# EasyEDA Pro project can-mcu.eprj, board remote-dim-a
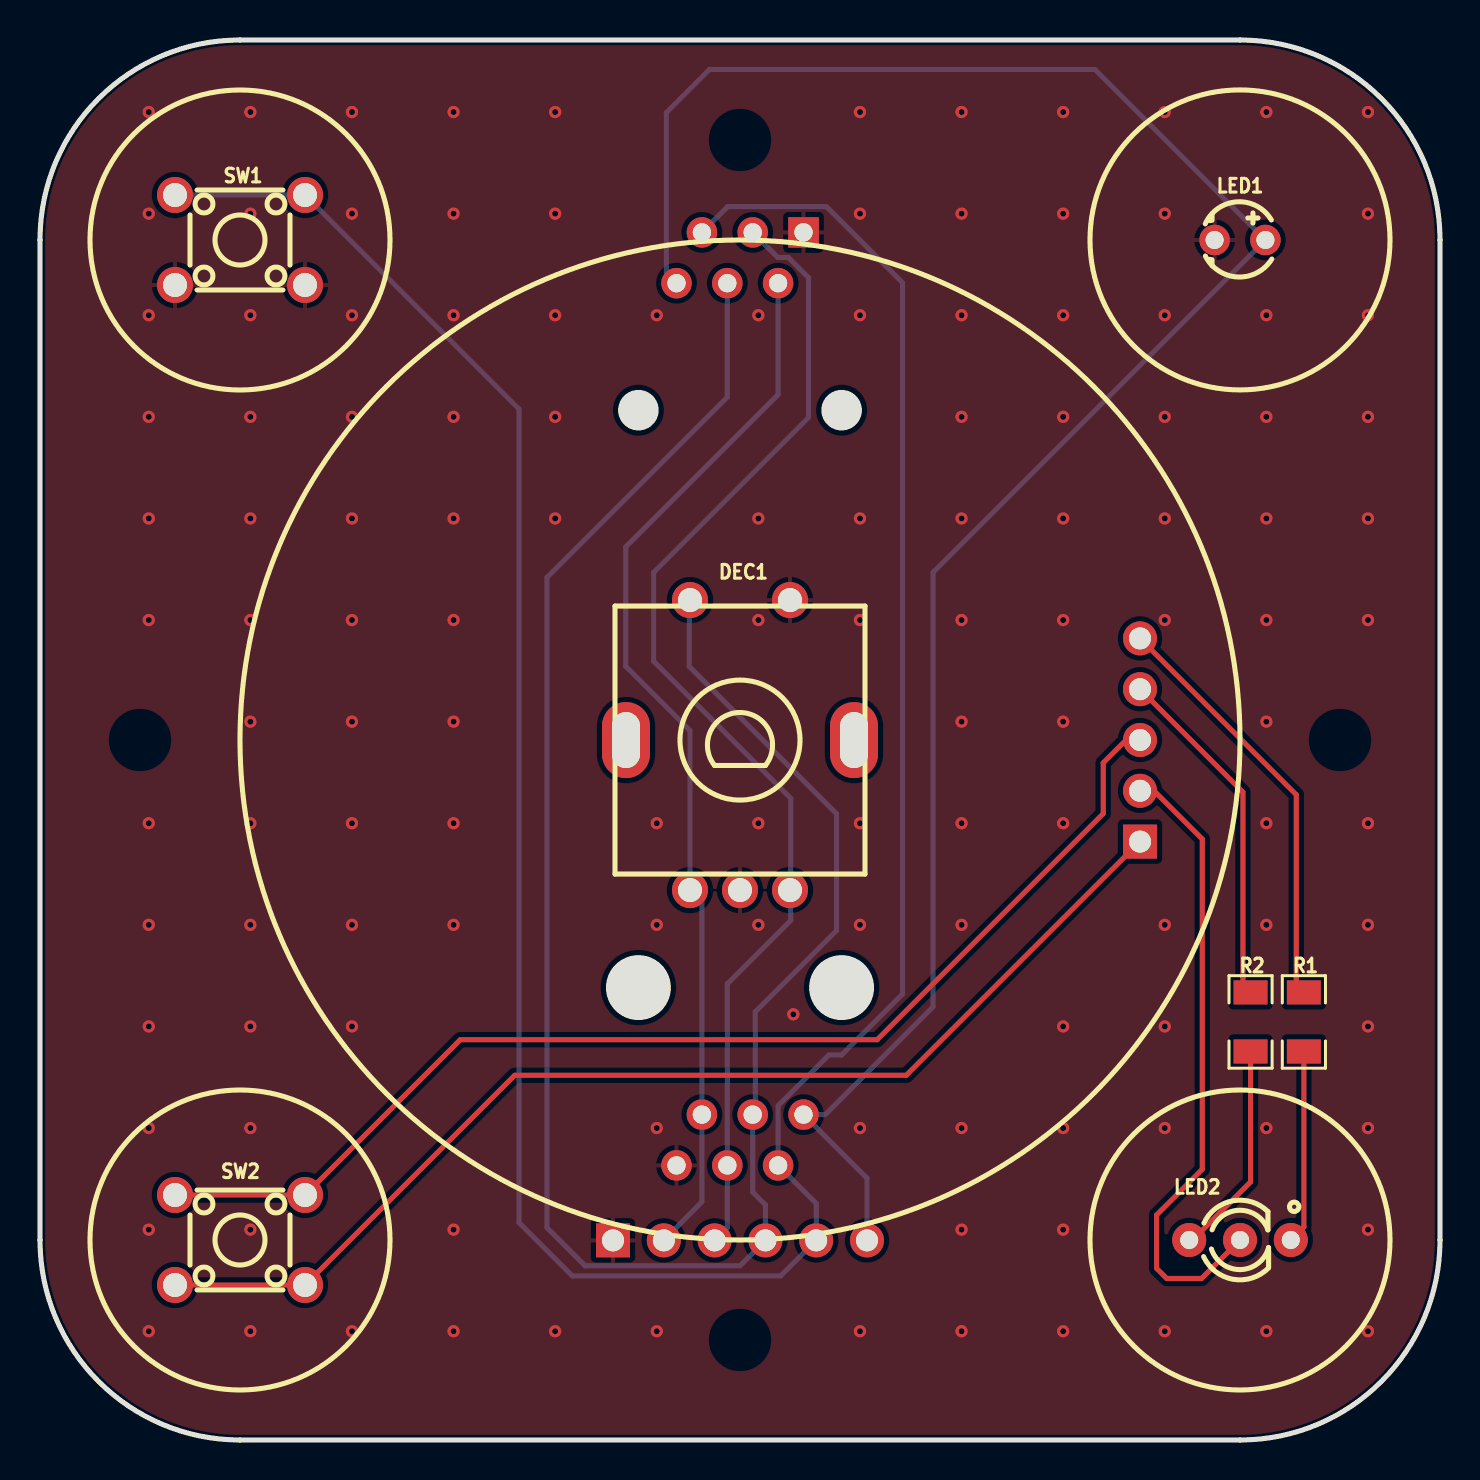
[diagram p15: board, top side]
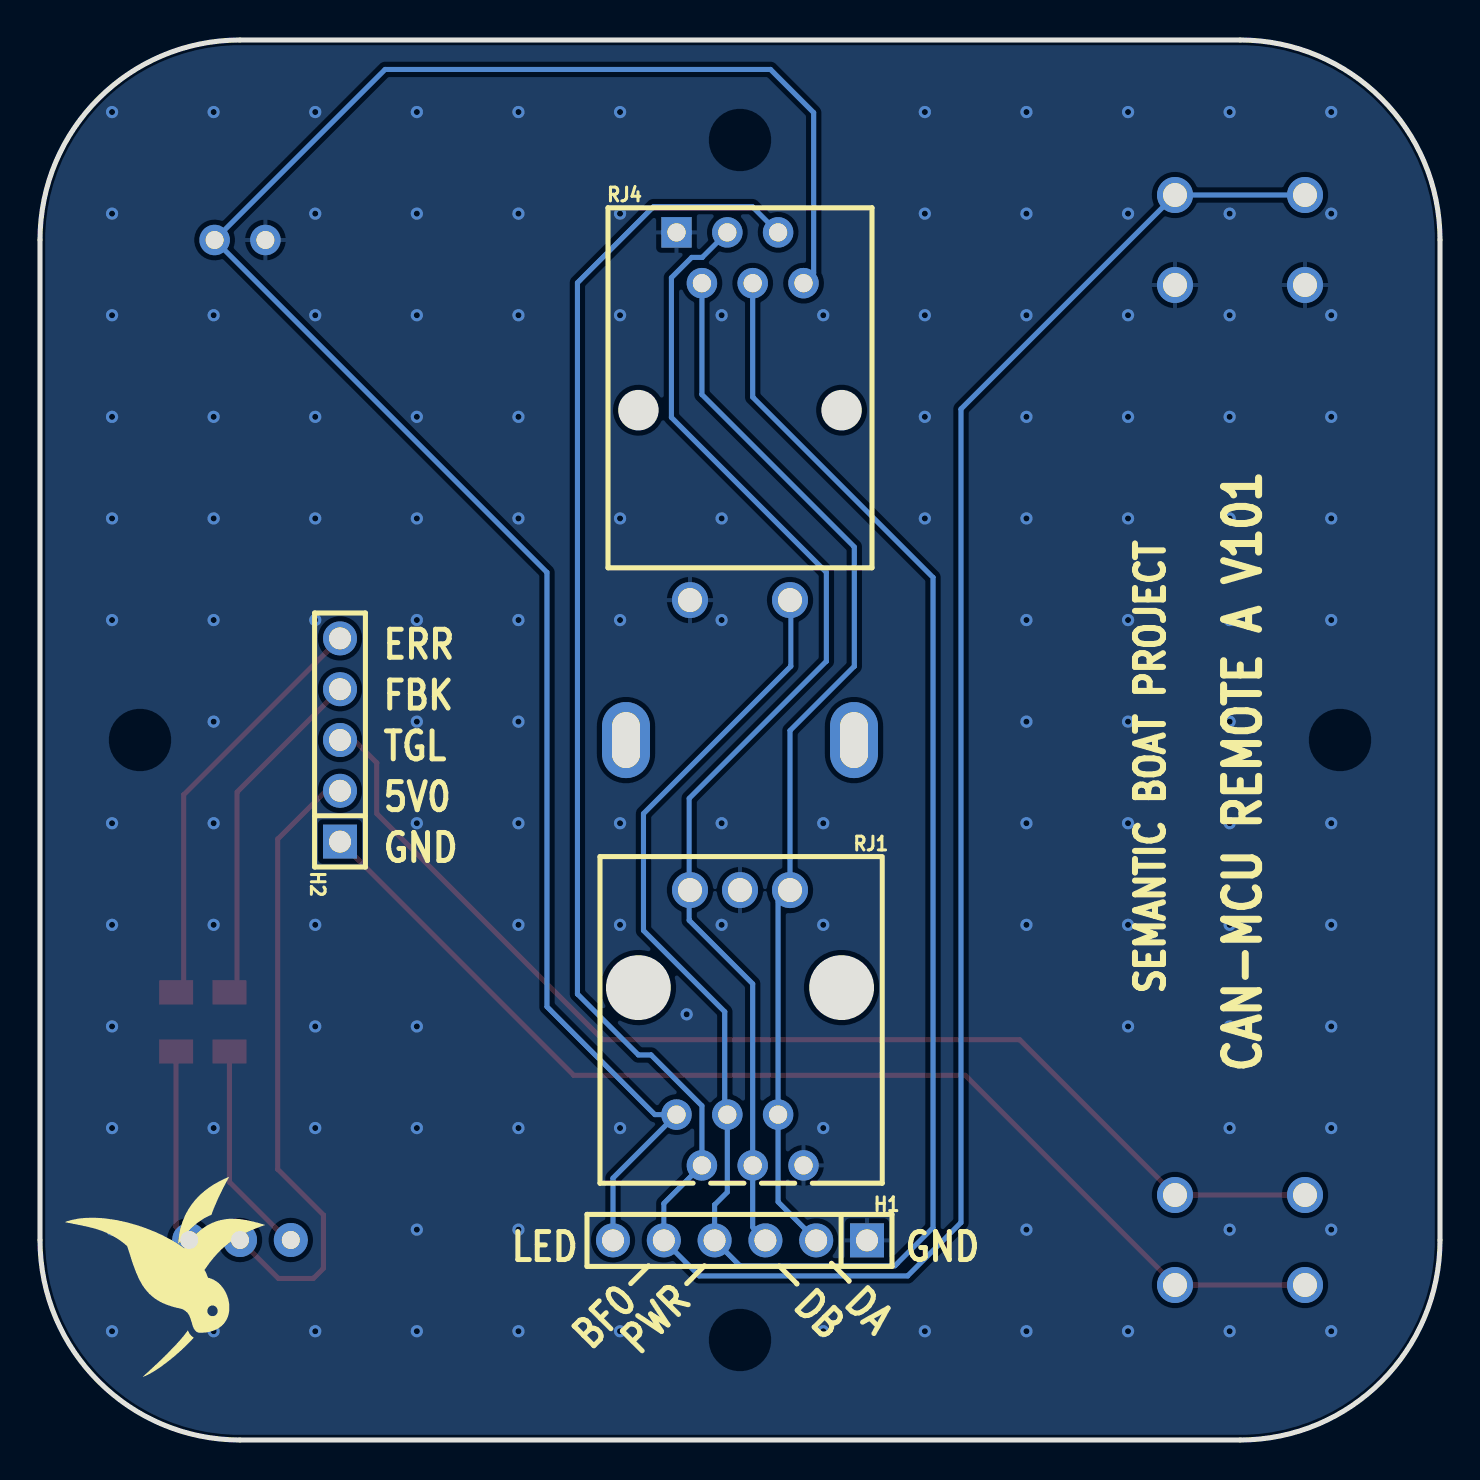
[diagram p16: board, bottom side, seen from below]

Outline 70 x 70 mm; copper layers: Top Layer, Bottom Layer. Coordinates in mm from the lower left corner of the outline.
Outline path: 0,60 0,10 arc(2.93,2.93) 10,0 60,0 arc(67.07,2.93) 70,10 70,60 arc(67.07,67.07) 60,70 10,70 arc(2.93,67.07) 0,60
Stack: Top Layer 0.035mm / Dielectric1 1.51mm FR4 er 4.5 / Bottom Layer 0.035mm

## Design rules (mm)
template: JLCPCB Capability(Two Layers Board)
spacing copperThickness1oz (default): track to track 0.102, other pairs 0.152 to 0.3
spacing copperThickness2oz: track to track 0.203, other pairs 0.152 to 0.3
track width copperThickness1oz (default): min 0.127, default 0.254, max 2.54
track width copperThickness2oz: min 0.203, default 0.254, max 2.54
differential pair differentialPair (default): width min 0.127, default 0.254, max 2.54; gap min 0.152, default 0.152
via viaSize (default): diameter min 0.5, default 0.61, max 10; hole min 0.3, default 0.305, max 6.3

## Placement (name value [footprint] x y rotation side)
DEC1  PEC11R-4215F-S0024  [SW-TH_5P-L12.5-W13.4-P2.50-LS14.5]  35 34.75 0 top
H1  PZ254V-11-06P  [HDR-TH_6P-P2.54-V-M]  35 9.98 0 bottom
H2  PZ254V-11-05P  [HDR-TH_5P-P2.54-V-M]  55 35 90 bottom
LED1  TZ-L2-03YYBYG1GDJ30-001  [LED-TH_BD3.8-P2.54-RD]  60 60 0 top
LED2  TZ-LAMP03RG4HD-A  [LED-TH_3P-BD3.9-P2.54-R-BI]  60 10 0 top
R1  470Ω  [R1206]  63.19 20.9 270 top
R2  470Ω  [R1206]  60.53 20.9 270 top
RJ1  428786218  [RJ45-TH_428786218]  35 15 180 bottom
RJ4  MTJ-665X1  [RE45-TH_MTJ-665X1]  35 59.11 180 bottom
SW1  TC-6610-8-260G  [SW-TH_4P-L5.0-W5.0-P4.50-LS6.5]  10 60 0 top
SW2  TC-6610-8-260G  [SW-TH_4P-L5.0-W5.0-P4.50-LS6.5]  10 10 0 top

## Footprints (pads in the part's own frame, mm; a bottom-side part is the same pattern mirrored in y, then rotated)
HDR-TH_5P-P2.54-V-M
  rect 1.7x1.7 hole 1.1: 1(-5.08,0)
  round 1.7 hole 1.1: 2(-2.54,0) 3(0,0) 4(2.54,0) 5(5.08,0)
HDR-TH_6P-P2.54-V-M
  rect 1.7x1.7 hole 1.1: 1(-6.35,0)
  round 1.7 hole 1.1: 2(-3.81,0) 3(-1.27,0) 4(1.27,0) 5(3.81,0) 6(6.35,0)
LED-TH_3P-BD3.9-P2.54-R-BI
  round 1.7 hole 0.9: 1(2.54,0) 2(0,0) 3(-2.54,0)
LED-TH_BD3.8-P2.54-RD
  round 1.524 hole 0.9: 1(-1.27,0) 2(1.27,0)
R1206
  rect 1.208x1.701 smd: 1(-1.479,0) 2(1.479,0)
RE45-TH_MTJ-665X1
  rect 1.524x1.524 hole 0.914: 1(-3.175,1.27)
  round 1.524 hole 0.914: 2(-1.905,-1.27) 3(-0.635,1.27) 4(0.635,-1.27) 5(1.905,1.27) 6(3.175,-1.27)
RJ45-TH_428786218
  round 1.524 hole 0.914: 1(3.175,-1.27) 2(1.905,1.27) 3(0.635,-1.27) 4(-0.635,1.27) 5(-1.905,-1.27) 6(-3.175,1.27)
SW-TH_4P-L5.0-W5.0-P4.50-LS6.5
  round 1.8 hole 1.2: 1(-3.25,2.25) 2(3.25,2.25) 3(-3.25,-2.25) 4(3.25,-2.25)
SW-TH_5P-L12.5-W13.4-P2.50-LS14.5
  round 1.8 hole 1.2: 1(-2.5,-7.25) 2(0,-7.25) 3(2.5,-7.25) 4(-2.5,7.25) 5(2.5,7.25)
  oval 2.4x3.8 hole 1.4x2.8: 7(-5.7,0.25) 8(5.7,0.25)

## Nets
As in the schematic.

Pads without a net: DEC1 7 8

## Via types
v1: diameter 0.61, hole 0.305, Top Layer to Bottom Layer, 129 vias

## Routing (per net, layer and track width the routed paths; a pad name or vN(x,y) marks a point on that pad's centre or on a via; arc(x,y) is an arc through that point)
GND:
  vias: v1(5.44,66.4) v1(5.44,61.32) v1(5.44,56.24) v1(5.44,51.16) v1(5.44,46.08) v1(5.44,41) v1(5.44,30.84) v1(5.44,25.76) v1(5.44,20.68) v1(5.44,15.6) v1(5.44,10.52) v1(5.44,5.44) v1(10.52,66.4) v1(10.52,61.32) v1(10.52,56.24) v1(10.52,51.16) v1(10.52,46.08) v1(10.52,41) v1(10.52,35.92) v1(10.52,30.84) v1(10.52,25.76) v1(10.52,20.68) v1(10.52,15.6) v1(10.52,10.52) v1(10.52,5.44) v1(15.6,66.4) v1(15.6,61.32) v1(15.6,56.24) v1(15.6,51.16) v1(15.6,46.08) v1(15.6,41) v1(15.6,35.92) v1(15.6,30.84) v1(15.6,25.76) v1(15.6,20.68) v1(15.6,5.44) v1(20.68,66.4) v1(20.68,61.32) v1(20.68,56.24) v1(20.68,51.16) v1(20.68,46.08) v1(20.68,41) v1(20.68,35.92) v1(20.68,30.84) v1(20.68,25.76) v1(20.68,10.52) v1(20.68,5.44) v1(25.76,66.4) v1(25.76,61.32) v1(25.76,56.24) v1(25.76,51.16) v1(25.76,46.08) v1(25.76,5.44) v1(30.84,56.24) v1(30.84,30.84) v1(30.84,25.76) v1(30.84,15.6) v1(30.84,5.44) v1(35.92,56.24) v1(35.92,46.08) v1(35.92,41) v1(35.92,30.84) v1(35.92,25.76) v1(37.67,21.28) v1(41,66.4) v1(41,61.32) v1(41,56.24) v1(41,46.08) v1(41,41) v1(41,30.84) v1(41,25.76) v1(41,15.6) v1(41,5.44) v1(46.08,66.4) v1(46.08,61.32) v1(46.08,56.24) v1(46.08,51.16) v1(46.08,46.08) v1(46.08,41) v1(46.08,35.92) v1(46.08,30.84) v1(46.08,25.76) v1(46.08,15.6) v1(46.08,10.52) v1(46.08,5.44) v1(51.16,66.4) v1(51.16,61.32) v1(51.16,56.24) v1(51.16,51.16) v1(51.16,46.08) v1(51.16,41) v1(51.16,35.92) v1(51.16,30.84) v1(51.16,20.68) v1(51.16,15.6) v1(51.16,10.52) v1(51.16,5.44) v1(56.24,66.4) v1(56.24,61.32) v1(56.24,56.24) v1(56.24,51.16) v1(56.24,46.08) v1(56.24,41) v1(56.24,25.76) v1(56.24,20.68) v1(56.24,15.6) v1(56.24,5.44) v1(61.32,66.4) v1(61.32,56.24) v1(61.32,51.16) v1(61.32,46.08) v1(61.32,41) v1(61.32,35.92) v1(61.32,30.84) v1(61.32,25.76) v1(61.32,15.6) v1(61.32,5.44) v1(66.4,66.4) v1(66.4,61.32) v1(66.4,56.24) v1(66.4,51.16) v1(66.4,46.08) v1(66.4,41) v1(66.4,30.84) v1(66.4,25.76) v1(66.4,20.68) v1(66.4,15.6) v1(66.4,10.52) v1(66.4,5.44)
BTN_FUN_0: length 142.8
  Bottom Layer w0.254: 38.81,10 38.81,11.82 RJ1.5 36.91,16.71 39.44,19.25 40.08,19.25 43.13,22.3 43.13,57.86 39.32,61.67 34.38,61.67 RJ4.5 ; H1.5 37.03,8.2 26.62,8.2 23.95,10.87 23.95,51.55 SW1.2 SW1.1
BTN_POWER: length 100.3
  Bottom Layer w0.254: DEC1.4 32.46,41.96 32.46,38.68 39.83,31.32 39.83,25.47 35.76,21.41 35.76,16.4 RJ1.4 35.63,12.39 36.27,11.76 36.27,10 ; 34.37,57.84 34.37,52.14 25.35,43.13 25.35,10.62 27.25,8.71 35,8.71 H1.4
GPIO_PA0_T21: length 53.4
  Bottom Layer w0.254: 31.19,10 33.09,11.91 RJ1.2 33.09,26.9 DEC1.1 32.5,35.47 29.28,38.68 29.28,44.65 36.91,52.27 36.91,57.84
GPIO_PA1_T22: length 59.5
  Bottom Layer w0.254: RJ4.3 36.89,59.13 37.41,59.13 38.43,58.11 38.43,51.13 30.68,43.38 30.68,38.94 37.54,32.08 37.54,27.54 DEC1.3 37.54,27.46 37.54,25.98 34.37,22.81 RJ1.3 34.37,10.63 33.73,10
LED0: length 104.6
  Bottom Layer w0.254: 31.82,57.84 31.32,58.35 31.32,66.37 33.48,68.53 52.74,68.53 LED1.2 44.65,43.38 44.65,21.67 39.26,16.27 RJ1.6 41.35,13.09 41.35,10
SW_5V0: length 31.7
  Top Layer w0.254: H2.2 55.7,32.46 58.11,30.05 58.11,13.54 55.83,11.25 55.83,8.58 56.34,8.08 58.08,8.08 LED2.2
SW_ERROR: length 21.1
  Top Layer w0.254: H2.5 62.81,32.27 62.81,22.76 R1.1
SW_FEEDBACK: length 17.4
  Top Layer w0.254: R2.1 60.15,22.76 60.15,32.39 H2.4
SW_GND: length 57.4
  Top Layer w0.254: H2.1 43.32,18.24 23.74,18.24 SW2.4 SW2.3
SW_TOGGLE: length 59.2
  Top Layer w0.254: SW2.1 SW2.2 21.01,20.01 41.86,20.01 53.16,31.32 53.16,33.86 54.3,35 H2.3
$1N2414: length 9.7
  Top Layer w0.254: LED2.1 63.19,10.65 R1.2
$1N2494: length 10.8
  Top Layer w0.254: R2.2 60.53,12.9 57.62,10 LED2.3

## Copper pours and planes (outline as drawn; the poured copper is in the pictures)
GND on Top Layer: -1.19,71.45 71.58,71.45 71.58,-1.07 -1.19,-1.07
GND on Bottom Layer: -2.08,72.72 73.1,72.72 73.1,-2.59 -2.08,-2.59

## Text on the board
Bottom Silkscreen Layer: DA | PWR | BF0 | DB | LED | ERR | FBK | TGL | 5V0 | GND | SEMANTIC BOAT PROJECT | CAN-MCU REMOTE A V101
